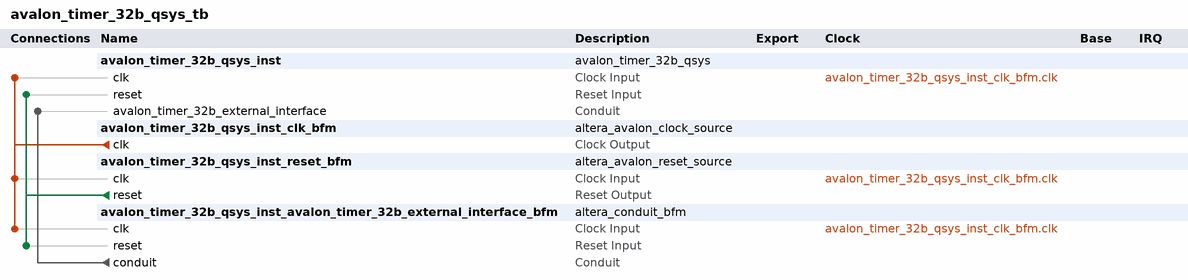
[diagram p0: system contents]
# Platform Designer (Qsys) system avalon_timer_32b_qsys_tb, Cyclone IV E EP4CE115F29C7
# Parameters at their usual value, and those the tool derives, are not listed.
package require -exact qsys 17.1
create_system avalon_timer_32b_qsys_tb
set_project_property DEVICE_FAMILY {Cyclone IV E}
set_project_property DEVICE EP4CE115F29C7

add_instance avalon_timer_32b_qsys_inst avalon_timer_32b_qsys 1.0

add_instance avalon_timer_32b_qsys_inst_clk_bfm altera_avalon_clock_source 17.1

add_instance avalon_timer_32b_qsys_inst_reset_bfm altera_avalon_reset_source 17.1
set_instance_parameter_value avalon_timer_32b_qsys_inst_reset_bfm ASSERT_HIGH_RESET 0
set_instance_parameter_value avalon_timer_32b_qsys_inst_reset_bfm INITIAL_RESET_CYCLES 50

add_instance avalon_timer_32b_qsys_inst_avalon_timer_32b_external_interface_bfm altera_conduit_bfm 17.1
set_instance_parameter_value avalon_timer_32b_qsys_inst_avalon_timer_32b_external_interface_bfm CLOCKED_SIGNAL true
set_instance_parameter_value avalon_timer_32b_qsys_inst_avalon_timer_32b_external_interface_bfm ENABLE_RESET true
set_instance_parameter_value avalon_timer_32b_qsys_inst_avalon_timer_32b_external_interface_bfm SIGNAL_DIRECTIONS input
set_instance_parameter_value avalon_timer_32b_qsys_inst_avalon_timer_32b_external_interface_bfm SIGNAL_ROLES conduit0
set_instance_parameter_value avalon_timer_32b_qsys_inst_avalon_timer_32b_external_interface_bfm SIGNAL_WIDTHS 1

# connections
add_connection avalon_timer_32b_qsys_inst_clk_bfm.clk avalon_timer_32b_qsys_inst.clk clock
add_connection avalon_timer_32b_qsys_inst_clk_bfm.clk avalon_timer_32b_qsys_inst_avalon_timer_32b_external_interface_bfm.clk clock
add_connection avalon_timer_32b_qsys_inst_clk_bfm.clk avalon_timer_32b_qsys_inst_reset_bfm.clk clock
add_connection avalon_timer_32b_qsys_inst_reset_bfm.reset avalon_timer_32b_qsys_inst.reset reset
add_connection avalon_timer_32b_qsys_inst_reset_bfm.reset avalon_timer_32b_qsys_inst_avalon_timer_32b_external_interface_bfm.reset reset
add_connection avalon_timer_32b_qsys_inst_avalon_timer_32b_external_interface_bfm.conduit avalon_timer_32b_qsys_inst.avalon_timer_32b_external_interface conduit

set_interconnect_requirement {$system} qsys_mm.clockCrossingAdapter HANDSHAKE
set_interconnect_requirement {$system} qsys_mm.enableEccProtection FALSE
set_interconnect_requirement {$system} qsys_mm.insertDefaultSlave FALSE
set_interconnect_requirement {$system} qsys_mm.maxAdditionalLatency 1

save_system avalon_timer_32b_qsys_tb.qsys
